# EAGLE design display (EAGLE 6.5.0)
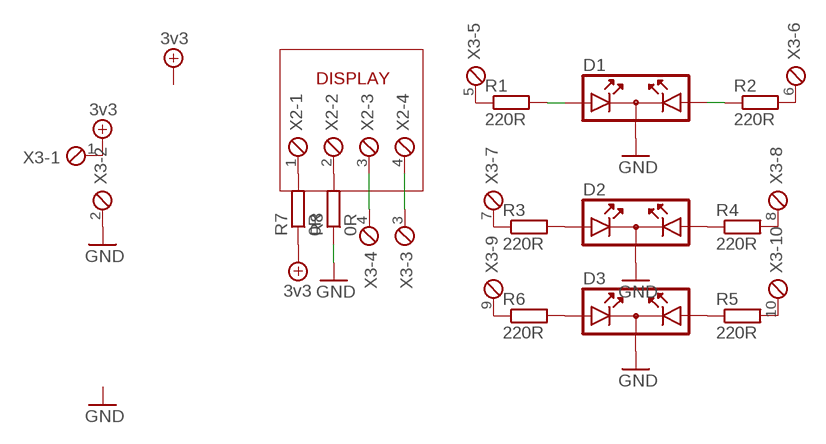
[diagram p0: schematic, sheet 1]

## Parts
D1  DUOLED  [DUOLED]
D2  DUOLED  [DUOLED]
D3  DUOLED  [DUOLED]
R1  220R  R-EU_R0603  [R0603]
R2  220R  R-EU_R0603  [R0603]
R3  220R  R-EU_R0603  [R0603]
R4  220R  R-EU_R0603  [R0603]
R5  220R  R-EU_R0603  [R0603]
R6  220R  R-EU_R0603  [R0603]
R7  0R  R-EU_R0603  [R0603]
R8  0R  R-EU_R0603  [R0603]
X2  MPT4  [4POL254]
X3  MPT10  [10POL254]

## Nets
+UB: R7.1 X3.1 ; supply symbol labelled 3v3
GND: D1.K D2.K D3.K R8.1 X3.2
N$1: D1.A1 R1.2
N$2: D1.A2 R2.1
N$3: X2.3 X3.4
N$4: X2.4 X3.3
N$5: R1.1 X3.5
N$6: R2.2 X3.6
N$7: D2.A1 R3.2
N$8: D2.A2 R4.1
N$9: D3.A2 R5.1
N$10: D3.A1 R6.2
N$11: R3.1 X3.7
N$12: R4.2 X3.8
N$13: R6.1 X3.9
N$14: R5.2 X3.10
N$15: R7.2 X2.1
N$16: R8.2 X2.2

## Notes on the sheet
- DISPLAY

## Library data of the parts
D1-D3 = special:DUOLED: Duo LED
R1-R8 = rcl:R-EU_: RESISTOR, European symbol
X2 = con-phoenix-254:MPT4: PHOENIX CONNECTOR; OC_FARNELL: unknown; OC_NEWARK: unknown
X3 = con-phoenix-254:MPT10: PHOENIX CONNECTOR; OC_FARNELL: unknown; OC_NEWARK: unknown

## Board
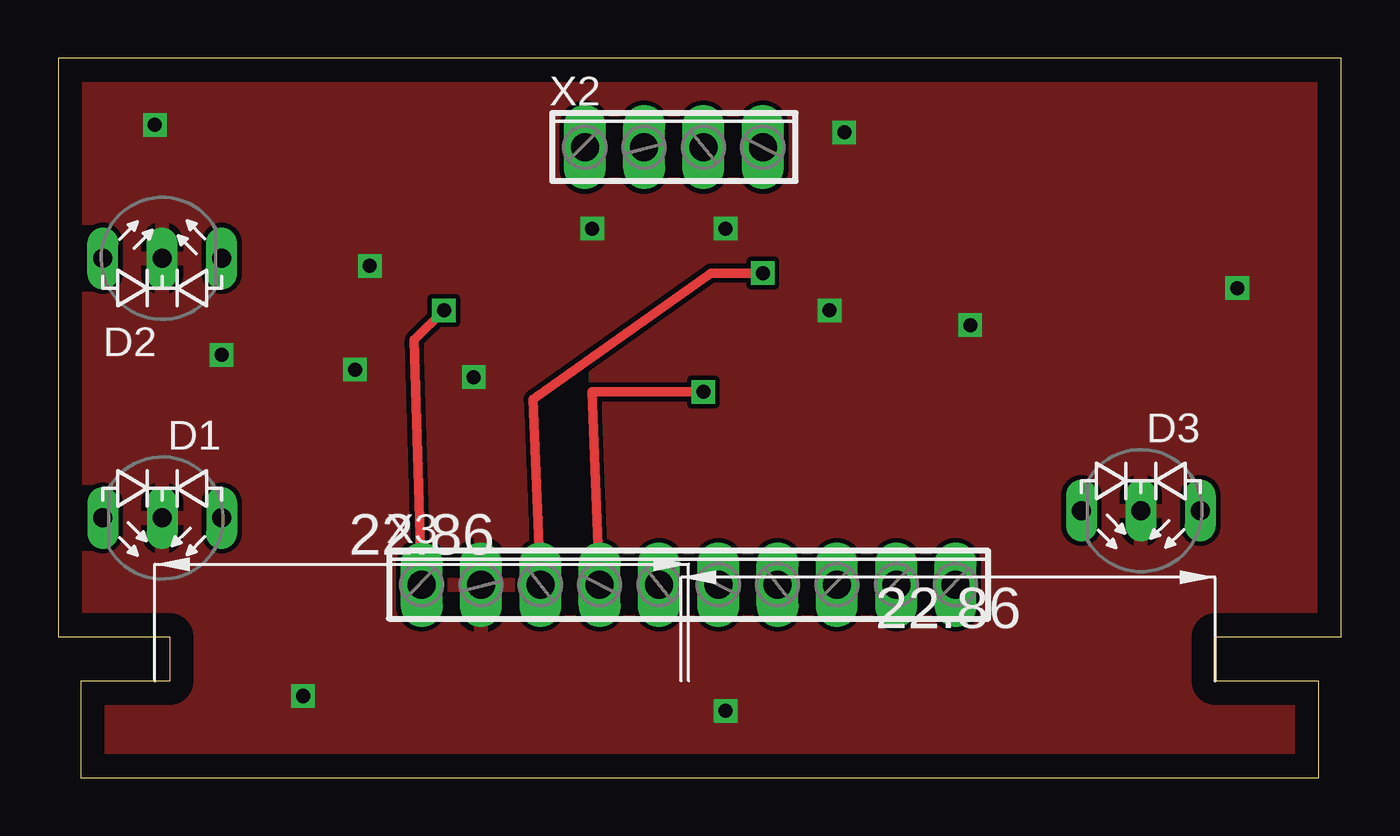
[diagram p1: board, top side]
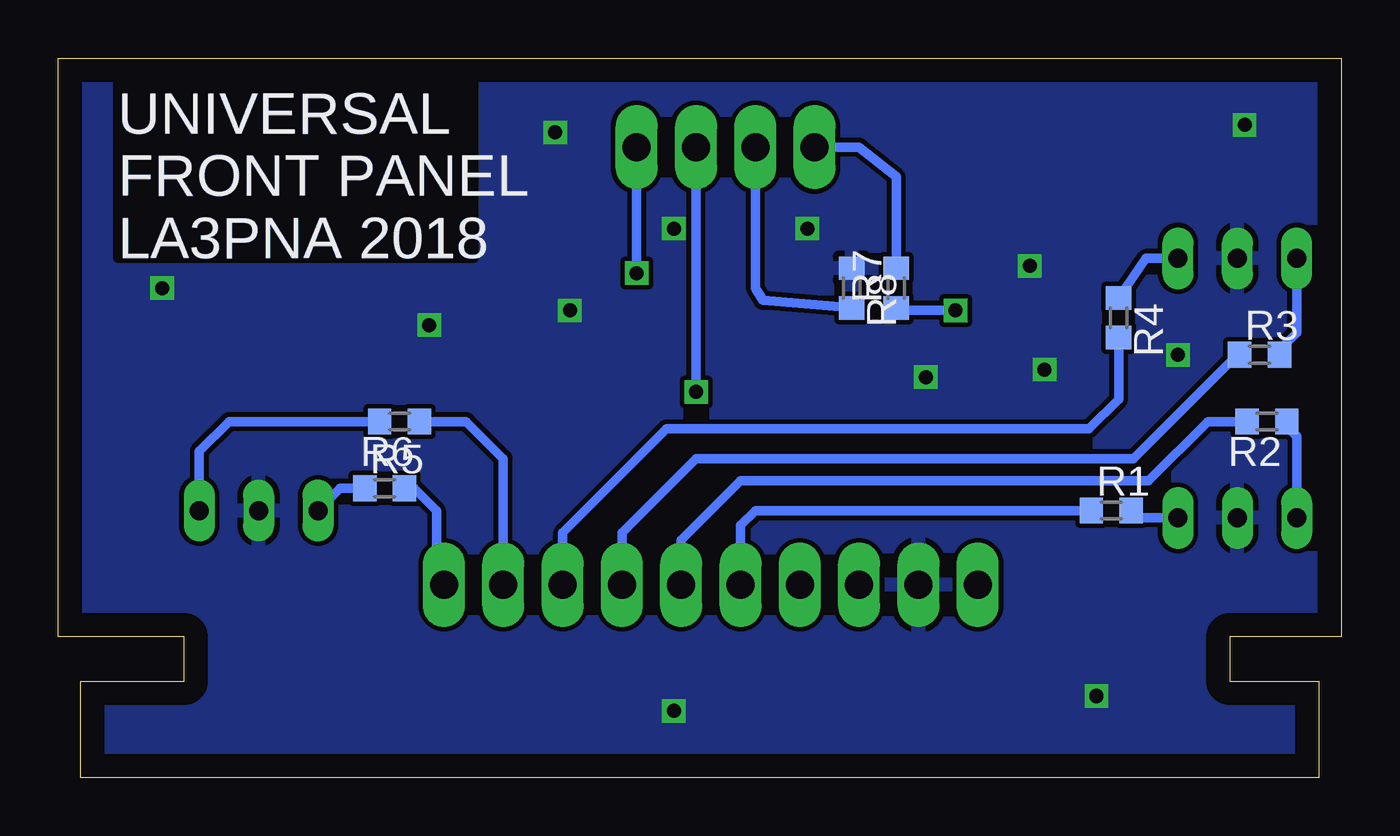
[diagram p2: board, bottom side, seen from below]

Size 54.93 x 30.79 mm. Coordinates in mm from the lower left corner, seen from the top.
Outline: 0.95,0 53.98,0 53.98,4.13 49.53,4.13 49.53,6.03 54.93,6.03 54.93,30.78 0,30.78 0,6.03 4.76,6.03 4.76,4.13 0.95,4.13 0.95,0
Copper layers (1*16): Top 0.035mm / dielectric 1.5mm / Bottom 0.035mm
Design rules "default": minimum track width 10mil, minimum drill 24mil, track to track 8mil, track to pad 8mil, pad to pad 8mil, via to via 8mil, smd to smd 8mil, copper to edge 40mil, drill to drill 8mil, minimum pad ring 10mil, minimum via ring 8mil, stop-mask expansion 4mil, vias tented up to drill 0mil, thermal gap 10mil

### Footprints (pad centres in the part's own frame; a part is rotated, then mirrored left to right if it is on the bottom)
DUOLED = drill 0.813 long: A1 -3.81,0; A2 1.27,0; K -1.27,0
R0603 = smd 1 x 1.1: 1 -0.85,0; 2 0.85,0
4POL254 = drill 1.2 long: 1 -3.81,0; 2 -1.27,0; 3 1.27,0; 4 3.81,0
10POL254 = drill 1.2 long: 1 -11.43,0; 2 -8.89,0; 3 -6.35,0; 4 -3.81,0; 5 -1.27,0; 6 1.27,0; 7 3.81,0; 8 6.35,0; 9 8.89,0; 10 11.43,0

### Placement (x,y rotation side)
D1  3.17,11.11 180 top
D2  5.71,22.23 0 top
D3  45.09,11.43 180 top
R1  9.84,11.43 0 bottom
R2  3.17,15.24 180 bottom
R3  3.49,18.1 0 bottom
R4  9.53,19.68 270 bottom
R5  40.96,12.38 0 bottom
R6  40.32,15.24 180 bottom
R7  19.05,20.95 90 bottom
R8  20.95,20.95 270 bottom
X2  26.35,26.99 0 top
X3  26.99,8.25 0 top

### Tracks (layer width: path | path; a pad name or v marks a point on that pad's centre or on a via)
+UB  (via drill 0.6)
  Top 0.406: X3.1 15.24,18.73 v16.51,20
  Bottom 0.406: v16.51,20 18.95,20 R7.1
GND  (via drill 0.6)
  other vias: 4.13,27.94 33.66,27.62 13.34,21.91 33.02,20 50.48,20.95 28.57,2.86 6.99,18.1 28.57,23.49 22.86,23.49 39.05,19.37 12.7,17.46 17.78,17.14 10.48,3.49
  pour Top: -3.49,34.29 65.09,34.29 65.09,-1.91 -3.49,-1.91
  pour Bottom: -6.67,35.24 65.72,33.66 65.72,-2.86 -7.62,-2.86
N$1
  Bottom 0.406: D1.A1 8.68,11.11 R1.2
N$2
  Bottom 0.406: R2.1 2.33,15.02 1.91,14.61 D1.A2
N$3  (via drill 0.6)
  Top 0.406: X3.4 22.86,16.51 v27.62,16.51
  Bottom 0.406: v27.62,16.51 X2.3
N$4  (via drill 0.6)
  Top 0.406: v30.16,21.59 27.94,21.59 20.32,16.19 X3.3
  Bottom 0.406: X2.4 v30.16,21.59
N$5
  Bottom 0.406: X3.5 25.72,10.79 25.08,11.43 R1.1
N$6
  Bottom 0.406: X3.6 28.26,10.16 25.72,12.7 8.26,12.7 5.71,15.24 R2.2
N$7
  Bottom 0.406: R3.2 2.64,18.31 1.91,19.05 D2.A1
N$8
  Bottom 0.406: D2.A2 8.36,22.23 R4.1
N$9
  Bottom 0.406: R5.1 42.86,12.38 D3.A2
N$10
  Bottom 0.406: R6.2 47.62,15.24 48.9,13.97 D3.A1
N$11
  Bottom 0.406: R3.1 4.45,18.1 8.89,13.65 27.62,13.65 30.8,10.48 X3.7
N$12
  Bottom 0.406: X3.8 33.34,10.48 28.89,14.92 10.79,14.92 9.53,16.19 R4.2
N$13
  Bottom 0.406: X3.9 35.88,13.65 37.47,15.24 R6.1
N$14
  Bottom 0.406: R5.2 39.69,12.38 38.73,11.43 38.73,9.21 38.42,8.89 X3.10
N$15
  Bottom 0.406: R7.2 19.05,25.72 20.64,26.99 X2.1
N$16
  Bottom 0.406: R8.2 24.77,20.42 25.08,20.96 X2.2

### Text on the board
Bottom: UNIVERSAL / FRONT PANEL / LA3PNA 2018
bNames: UNIVERSAL / FRONT PANEL / LA3PNA 2018